# Altium schematic sheet RGB-LED.SchDoc
size A; SheetNumber: 14; SheetTotal: 14
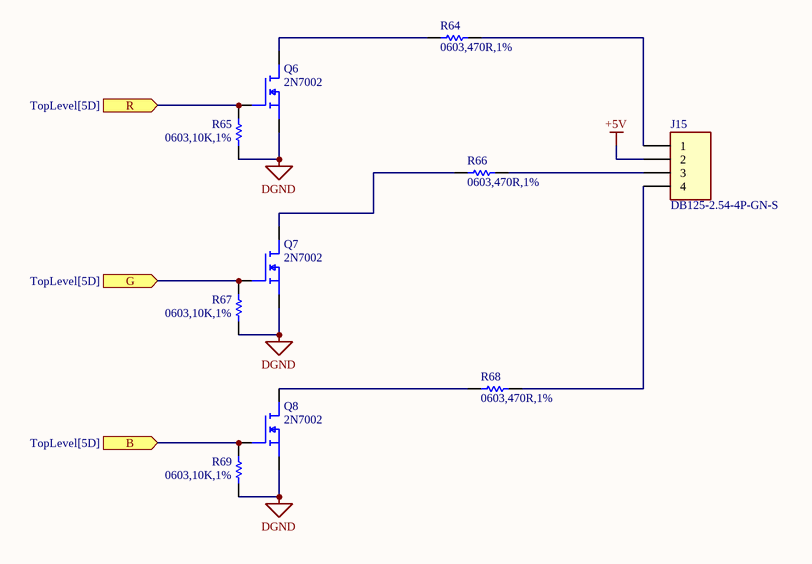
[diagram p0: RGB-LED.SchDoc]

## Parts
J15  DB125-2.54-4P-GN-S  [DB125-2_54-4P-GN]
Q6  2N7002  [SOT95P230X110-3N]
Q7  2N7002  [SOT95P230X110-3N]
Q8  2N7002  [SOT95P230X110-3N]
R64  0603,470R,1%  [RESC1608X90N]
R65  0603,10K,1%  [RESC1608X90N]
R66  0603,470R,1%  [RESC1608X90N]
R67  0603,10K,1%  [RESC1608X90N]
R68  0603,470R,1%  [RESC1608X90N]
R69  0603,10K,1%  [RESC1608X90N]

## Ports
B (in, see TopLevel[5D]), G (in, see TopLevel[5D]), R (in, see TopLevel[5D])

## Nets
+5V: J15.2
DGND: Q6.2(S) Q7.2(S) Q8.2(S) R65.1 R67.1 R69.1
B: Q8.1(G) R69.2 ; port B
G: Q7.1(G) R67.2 ; port G
R: Q6.1(G) R65.2 ; port R
NetJ15_1: J15.1 R64.2
NetJ15_3: J15.3 R66.2
NetJ15_4: J15.4 R68.2
NetQ6_3: Q6.3(D) R64.1
NetQ7_3: Q7.3(D) R66.1
NetQ8_3: Q8.3(D) R68.1

## Library data of the parts
J15 = DB125-2.54-4P-GN-S: 4 Position Wire to Board Terminal Block Through Hole 2.54mm; LCSC Part #: C918122; Manu Part #: DB125-2.54-4P-GN-S
Q6-Q8 = 2N7002: N-Channel 60V 300mA 830mW Surface Mount SOT-23; Manu Part #: 2N7002; LCSC Part #: C8545
R64 R66 R68 = 0603WAF4700T5E: -55℃~+155℃ 100mW 470Ω 75V Thick Film Resistor ±1% ±100ppm/℃ 0603 Chip Resistor - Surface Mount ROHS; LCSC Part #: C23179; Manu Part #: 0603WAF4700T5E
R65 R67 R69 = 0603WAF1002T5E: 100mW Thick Film Resistor 75V ±100ppm/℃ ±1% 10kΩ 0603 Chip Resistor - Surface Mount ROHS; LCSC Part #: C25804; Manu Part #: 0603WAF1002T5E